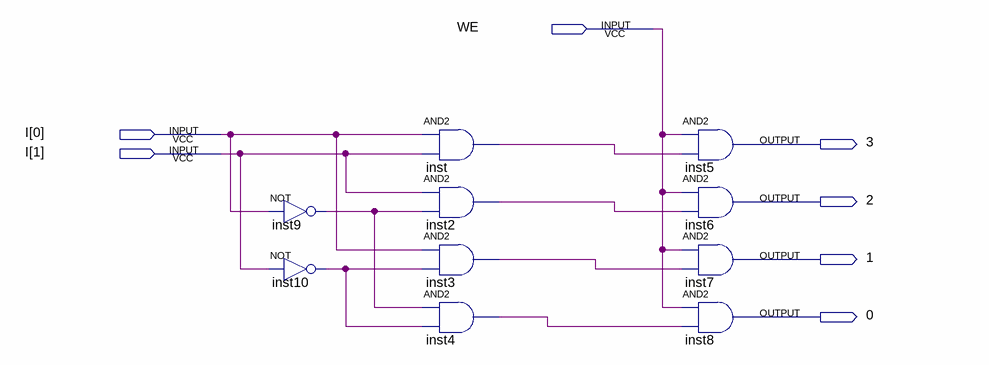
[diagram p0: schematic sheet]
// Quartus schematic decoder.bdf as structural Verilog: 10 symbols, 7 pins
module decoder (
  input  WE,
  input  [1:0] I,
  output \3 ,
  output \2 ,
  output \1 ,
  output \0 
);

  wire inst2_out, inst3_out, inst4_out, inst9_out, inst10_out, inst_out;

  not inst9 (inst9_out, I[0]);
  not inst10 (inst10_out, I[1]);
  and inst (inst_out, I[0], I[1]);
  and inst2 (inst2_out, I[1], inst9_out);
  and inst3 (inst3_out, I[0], inst10_out);
  and inst4 (inst4_out, inst9_out, inst10_out);
  and inst5 (\3 , WE, inst_out);
  and inst6 (\2 , WE, inst2_out);
  and inst7 (\1 , WE, inst3_out);
  and inst8 (\0 , WE, inst4_out);
endmodule
